# EAGLE design carte_pui (EAGLE 9.6.2)
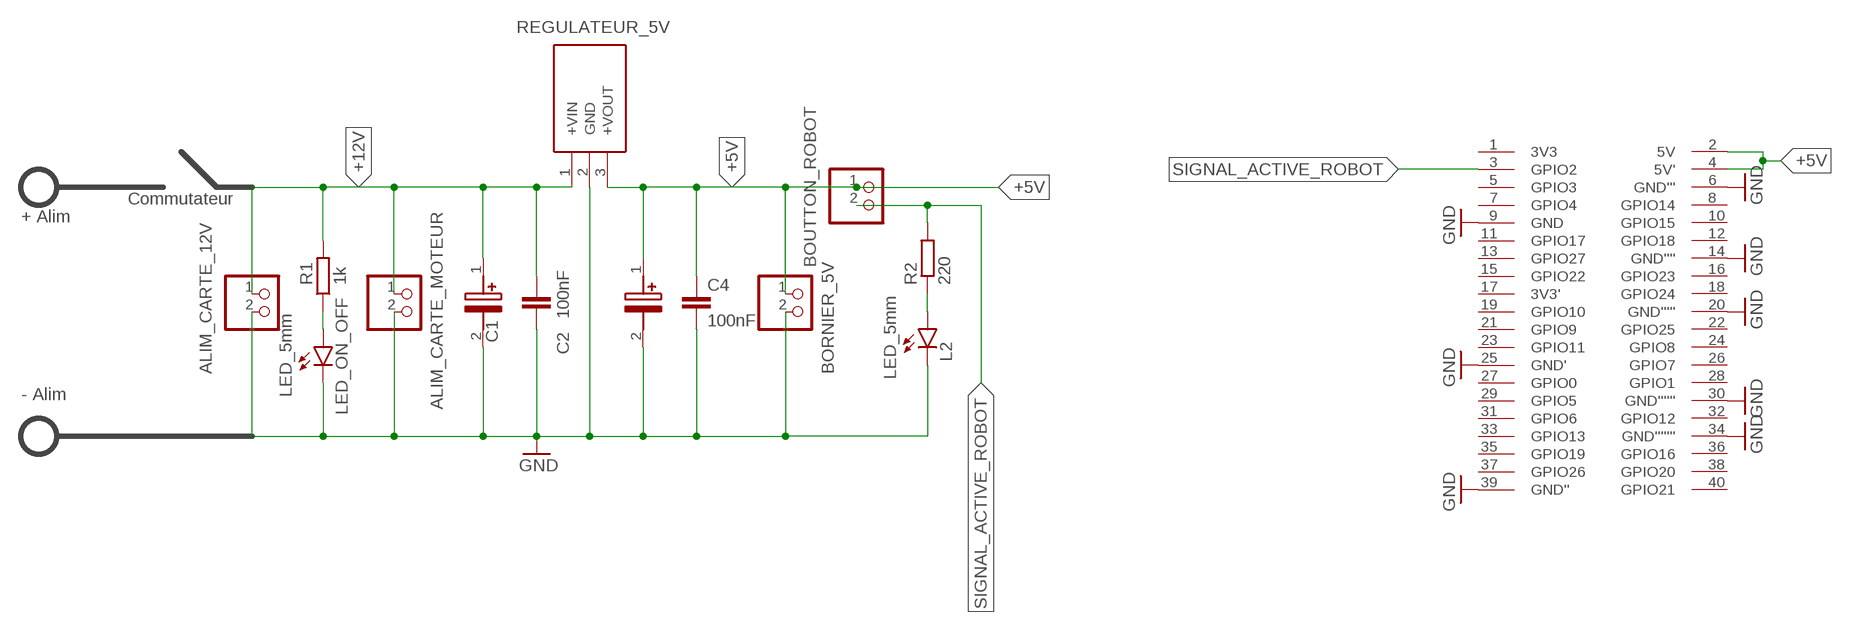
[diagram p0: schematic, sheet 1]

## Parts
ALIM_CARTE_12V  BORNIER_2_ROND_LARGE  [BORNIER_2_ROND_LARGE]
ALIM_CARTE_MOTEUR  BORNIER_2_ROND_LARGE  [BORNIER_2_ROND_LARGE]
BORNIER_5V  BORNIER_2_ROND_LARGE  [BORNIER_2_ROND_LARGE]
BOUTTON_ROBOT  BORNIER_2_ROND_LARGE  [BORNIER_2_ROND_LARGE]
C1  10uF  EEU-FR1C471B  [CAPPRD350W65D800H1300]
C2  100nF  CERAMIC_CAPACITOR  [C050-030X040]
C3  10uF  EEU-FR1C471B  [CAPPRD350W65D800H1300]
C4  100nF  CERAMIC_CAPACITOR  [C050-030X040]
L2  LED_5mm  LED5MM  [LED5MM]
LED_ON_OFF  LED_5mm  LED5MM  [LED5MM]
R1  1k  RESISTOR_1/4W90PAD  [0207/7-90]
R2  220  RESISTOR_1/4W90PAD  [0207/7-90]
REGULATEUR_5V  TSR_2-2450  [TSR-2]
U$1  PI4  [PI4]

## Nets
+5V: BORNIER_5V.1 BOUTTON_ROBOT.1 C3.1(+) C4.1 REGULATEUR_5V.3(+VOUT) U$1.2(5V) U$1.4(5V')
+12V: ALIM_CARTE_12V.1 ALIM_CARTE_MOTEUR.1 C1.1(+) C2.1 R1.2 REGULATEUR_5V.1(+VIN)
GND: ALIM_CARTE_12V.2 ALIM_CARTE_MOTEUR.2 BORNIER_5V.2 C1.2(-) C2.2 C3.2(-) C4.2 L2.K(C) LED_ON_OFF.K(C) REGULATEUR_5V.2(GND) U$1.6(GND''') U$1.9(GND) U$1.14(GND'''') U$1.20(GND''''') U$1.25(GND') U$1.30(GND'''''') U$1.34(GND''''''') U$1.39(GND'')
N$1: LED_ON_OFF.A R1.1
N$3: L2.A R2.1
SIGNAL_ACTIVE_ROBOT: BOUTTON_ROBOT.2 R2.2 U$1.3(GPIO2)
Unconnected: U$1.1(3V3) U$1.5(GPIO3) U$1.7(GPIO4) U$1.8(GPIO14) U$1.10(GPIO15) U$1.11(GPIO17) U$1.12(GPIO18) U$1.13(GPIO27) U$1.15(GPIO22) U$1.16(GPIO23) U$1.17(3V3') U$1.18(GPIO24) U$1.19(GPIO10) U$1.21(GPIO9) U$1.22(GPIO25) U$1.23(GPIO11) U$1.24(GPIO8) U$1.26(GPIO7) U$1.27(GPIO0) U$1.28(GPIO1) U$1.29(GPIO5) U$1.31(GPIO6) U$1.32(GPIO12) U$1.33(GPIO13) U$1.35(GPIO19) U$1.36(GPIO16) U$1.37(GPIO26) U$1.38(GPIO20) U$1.40(GPIO21)

## Notes on the sheet
- Commutateur
- + Alim
- - Alim

## Library data of the parts
ALIM_CARTE_12V ALIM_CARTE_MOTEUR BORNIER_5V BOUTTON_ROBOT = TerminalBlock:BORNIER_2_ROND_LARGE
C1 C3 = EEU-FR1C471B:EEU-FR1C471B: PANASONIC ELECTRONIC COMPONENTS - EEUFR1C471B - CAP, ALU ELEC, 470UF, 16V, RAD, REEL Source: Datasheet <http://industrial.panasonic.com/cdbs/www-data/pdf/RDF0000/ABA0000C1259.pdf>; DESCRIPTION: PANASONIC ELECTRONIC COMPONENTS - EEUFR1C471B - CAP, ALU ELEC, 470UF, 16V, RAD, REEL; HEIGHT: 13mm; MANUFACTURER_NAME: Panasonic; MANUFACTURER_PART_NUMBER: EEU-FR1C471B; MOUSER_PART_NUMBER: 667-EEU-FR1C471B; MOUSER_PRICE-STOCK: https://www.mouser.co.uk/ProductDetail/Panasonic/EEU-FR1C471B?qs=n1SRcuzDZT0M7ScwgdMxZQ%3D%3D
C2 C4 = Basics:CERAMIC_CAPACITOR: CAPACITOR grid 5 mm, outline 3 x 4 mm
L2 LED_ON_OFF = Basics:LED5MM
R1 R2 = Basics:RESISTOR_1/4W: AXIAL RESISTOR type 0207 8.76 mm pitch, 6.50 mm body lengh, 2.50 mm body diameter, 25 mil (0.64mm) lead diameter
REGULATEUR_5V = TSR_2-2450:TSR_2-2450: 2 Amp POL switching regulator, 3.0 to -36 VDC input, pos.-pos. circuit, LM78 compatible, SIP-3 Source: Datasheet <https://tracopower.com/tsr2-datasheet/>; DESCRIPTION: 2 Amp POL switching regulator, 3.0 to -36 VDC input, pos.-pos. circuit, LM78 compatible, SIP-3; HEIGHT: mm; MANUFACTURER_NAME: Traco Power; MANUFACTURER_PART_NUMBER: TSR 2-2450; MOUSER_PART_NUMBER: 495-TSR2-2450; MOUSER_PRICE-STOCK: https://www.mouser.co.uk/ProductDetail/TRACO-Power/TSR-2-2450?qs=NtE2QagKf6RzknAolzm%2FTQ%3D%3D
U$1 = pi4:PI4

## Board
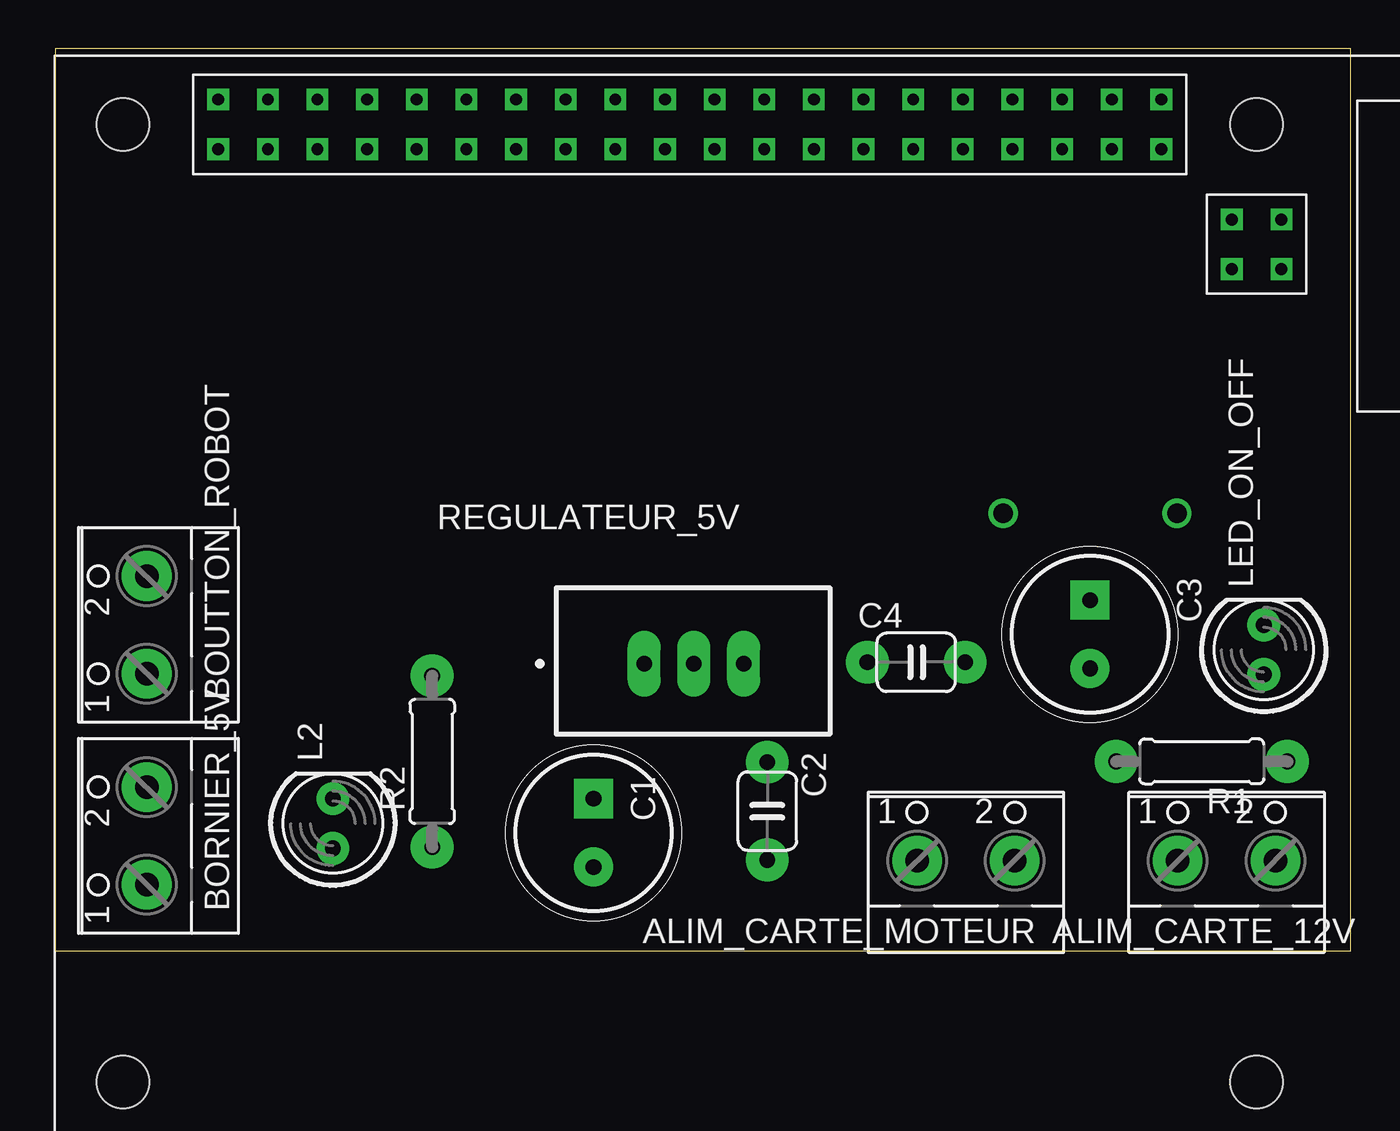
[diagram p1: board, top side]
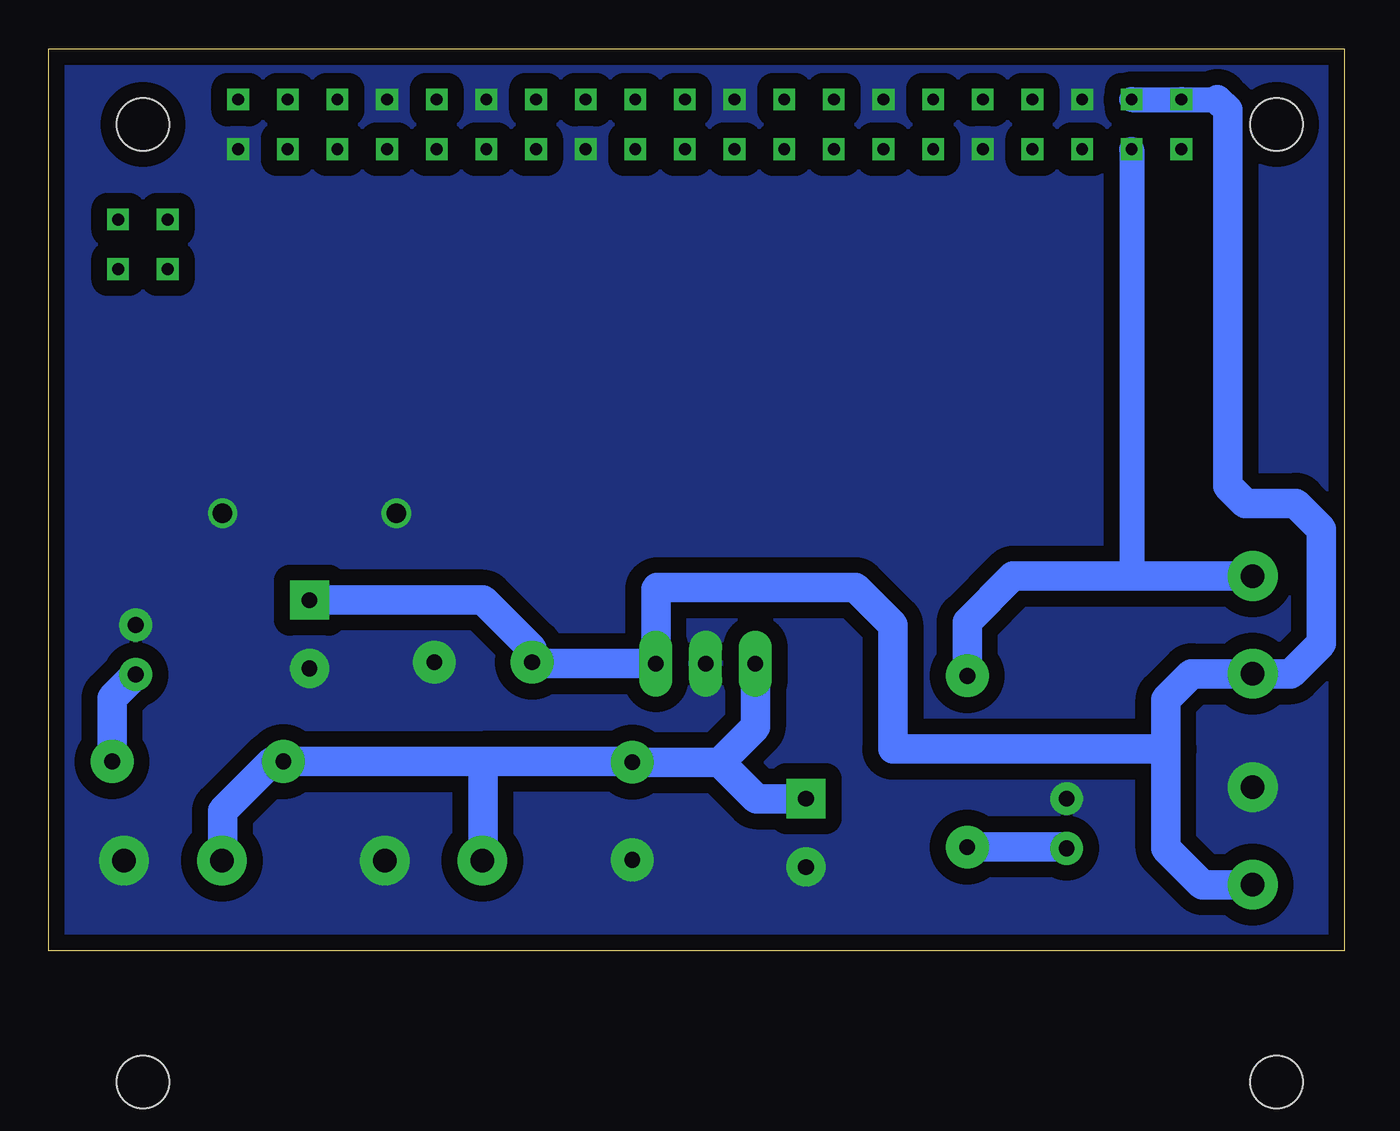
[diagram p2: board, bottom side, seen from below]

Size 66.27 x 46.14 mm. Coordinates in mm from the lower left corner, seen from the top.
Outline: 66.27,46.14 0,46.14 0,0 66.27,0 66.27,46.14
Copper layers (1*16): Top 0.035mm / dielectric 1.5mm / Bottom 0.035mm
Design rules "default *": minimum track width 8mil, minimum drill 0.35mm, track to track 6mil, track to pad 6mil, pad to pad 6mil, via to via 6mil, smd to smd 6mil, copper to edge 16mil, drill to drill 6mil, minimum pad ring 10mil, minimum via ring 8mil, stop-mask expansion 4mil, vias tented up to drill 0mil, thermal gap 0mil

### Footprints (pad centres in the part's own frame; a part is rotated, then mirrored left to right if it is on the bottom)
BORNIER_2_ROND_LARGE = drill 1.2 pad 2.54: 1 -2.5,0; 2 2.5,0
CAPPRD350W65D800H1300 = drill 0.8 pad 2 square: 1 0,0 | drill 0.8 pad 2: 2 3.5,0
C050-030X040 = drill 0.8 pad 2.184: 1 -2.5,0; 2 2.5,0
LED5MM = drill 0.813 pad 1.676: A -1.27,0; K 1.27,0
0207/7-90 = drill 0.8 pad 2.184: 1 -4.38,0 | drill 0.813 pad 2.184: 2 4.38,0
TSR-2 = drill 0.8 pad 1.676 long: 1 4.5,-3.89; 2 7.04,-3.89; 3 9.58,-3.89
PI4 = drill 0.6 square: 1 -34.13,23.23; 2 -34.13,25.77; 3 -31.59,23.23; 4 -31.59,25.77; 5 -29.05,23.23; 6 -29.05,25.77; 7 -26.51,23.23; 8 -26.51,25.77; 9 -23.97,23.23; 10 -23.97,25.77; 11 -21.43,23.23; 12 -21.43,25.77; 13 -18.89,23.23; 14 -18.89,25.77; 15 -16.35,23.23; 16 -16.35,25.77; 17 -13.81,23.23; 18 -13.81,25.77; 19 -11.27,23.23; 20 -11.27,25.77; 21 -8.73,23.23; 22 -8.73,25.77; 23 -6.19,23.23; 24 -6.19,25.77; 25 -3.65,23.23; 26 -3.65,25.77; 27 -1.11,23.23; 28 -1.11,25.77; 29 1.43,23.23; 30 1.43,25.77; 31 3.97,23.23; 32 3.97,25.77; 33 6.51,23.23; 34 6.51,25.77; 35 9.05,23.23; 36 9.05,25.77; 37 11.59,23.23; 38 11.59,25.77; 39 14.13,23.23; 40 14.13,25.77; P$41 17.73,19.63; P$42 20.27,19.63; P$43 17.73,17.09; P$44 20.27,17.09 | hole 2.7: -39,24.5; 19,24.5; -39,-24.5; 19,-24.5

### Placement (x,y rotation side)
ALIM_CARTE_12V  59.92,4.6 0 top
ALIM_CARTE_MOTEUR  46.59,4.6 0 top
BORNIER_5V  4.67,5.87 90 top
BOUTTON_ROBOT  4.67,16.66 90 top
C1  27.54,7.77 270 top
C2  36.43,7.14 270 top
C3  52.94,17.93 270 top
C4  44.05,14.76 0 top
L2  14.2,6.5 90 top
LED_ON_OFF  61.83,15.39 90 top
R1  58.65,9.68 180 top
R2  19.28,9.68 90 top
REGULATEUR_5V  25.63,18.57 0 top
U$1  42.46,17.78 0 top

### Tracks (layer width: path | path; a pad name or v marks a point on that pad's centre or on a via)
+5V
  Bottom 1.27: U$1.4 U$1.2 6.48,43.55
  Bottom 1.5: BORNIER_5V.1 7.26,3.37 9.12,5.24 9.12,10.32 | 9.12,10.32 9.12,12.86 7.81,14.17 BOUTTON_ROBOT.1 2.73,14.17 1.17,15.73 1.17,21.58 2.47,22.88 5.07,22.88 5.96,23.77 5.96,43.03 6.48,43.55 | 9.12,10.32 23.09,10.32 23.09,16.67 24.99,18.57 35.15,18.57 35.21,18.52 REGULATEUR_5V.3 41.47,14.68 C4.1 41.54,15.44 44.04,17.94 C3.1
+12V
  Bottom 1.5: ALIM_CARTE_12V.1 57.38,4.64 57.38,7.14 54.84,9.68 R1.2 44.04,9.68 | 44.04,9.68 36.47,9.68 C2.1 31.94,9.64 | ALIM_CARTE_MOTEUR.1 44.04,4.64 44.04,9.68 | 31.94,9.64 30.08,7.78 C1.1 | REGULATEUR_5V.1 30.13,11.45 31.94,9.64
GND  (via drill 1)
  other vias: 57.38,22.38 48.49,22.38
  pour Bottom (isolate 0.813): 66.27,46.51 66.27,-3.02 0.23,-3.02 0.23,46.51
N$1
  Bottom 1.5: R1.1 63.03,12.92 LED_ON_OFF.A
N$3
  Bottom 1.5: L2.A 14.26,5.3 R2.1
SIGNAL_ACTIVE_ROBOT
  Bottom 1.27: U$1.3 10.87,19.33
  Bottom 1.5: R2.2 19.28,16.82 16.94,19.17 10.71,19.17 | 10.71,19.17 BOUTTON_ROBOT.2 | 10.87,19.33 10.71,19.17